# Altium schematic sheet 04_BLE & WIFI module.SchDoc
size A4
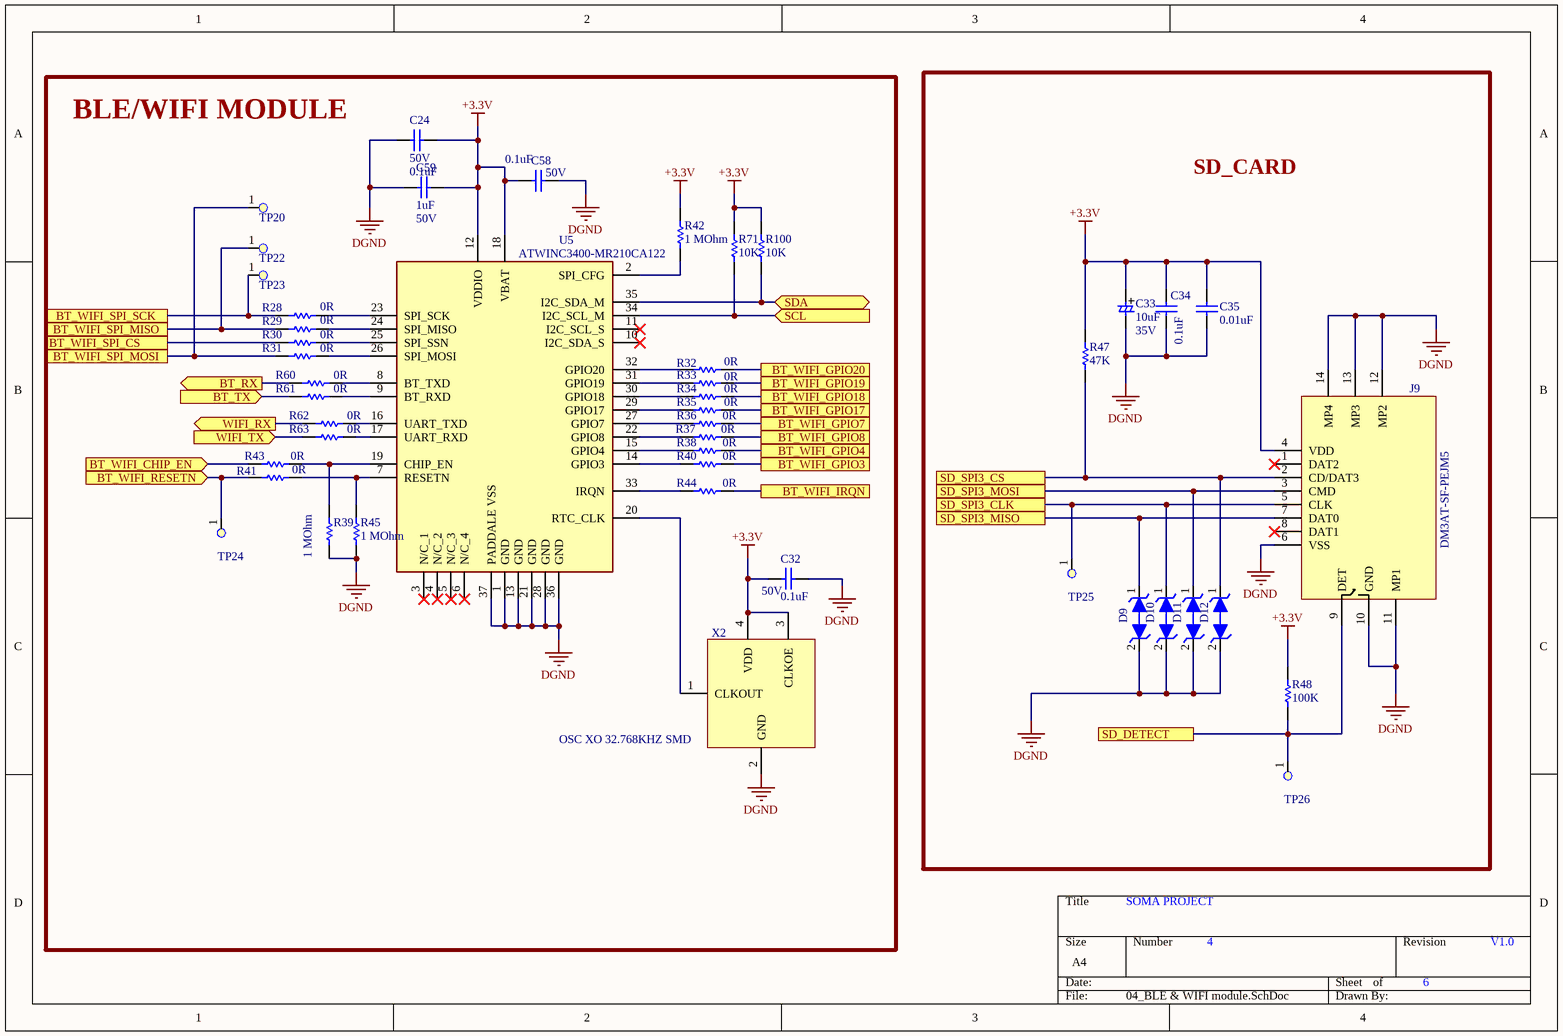
[diagram p0: 04_BLE & WIFI module.SchDoc]

## Parts
C24  Rating: 50V  [C0402]  (hidden comment: 0.1uF)
C32  Rating: 50V  [C0402]  (hidden comment: 0.1uF)
C33  Rating: 35V  [CAPAE430X540N]  (hidden comment: 10uF)
C34  0.1uF  [C0603]
C35  0.01uF  [C0402]
C58  Rating: 50V  [C0402]  (hidden comment: 0.1uF)
C59  value 1uF  Rating: 50V  [C0603]  (hidden comment: CAP CER 1UF 50V X5R 0603)
D9  TVS DIODE 3.3VWM 11.5VC SOD923  [SOD1006X40N_BI]  (value not drawn)
D10  TVS DIODE 3.3VWM 11.5VC SOD923  [SOD1006X40N_BI]  (value not drawn)
D11  TVS DIODE 3.3VWM 11.5VC SOD923  [SOD1006X40N_BI]  (value not drawn)
D12  TVS DIODE 3.3VWM 11.5VC SOD923  [SOD1006X40N_BI]  (value not drawn)
J9  value DM3AT-SF-PEJM5  [HIROSE_DM3AT-SF-PEJM5]  (hidden comment: CONN MICRO SD CARD PUSH-PUSH R/A)
R28  value 0R  [R0402]  (hidden comment: RES SMD 0 OHM JUMPER 1/16W 0402)
R29  value 0R  [R0402]  (hidden comment: RES SMD 0 OHM JUMPER 1/16W 0402)
R30  value 0R  [R0402]  (hidden comment: RES SMD 0 OHM JUMPER 1/16W 0402)
R31  value 0R  [R0402]  (hidden comment: RES SMD 0 OHM JUMPER 1/16W 0402)
R32  value 0R  [R0402]  (hidden comment: RES SMD 0 OHM JUMPER 1/16W 0402)
R33  value 0R  [R0402]  (hidden comment: RES SMD 0 OHM JUMPER 1/16W 0402)
R34  value 0R  [R0402]  (hidden comment: RES SMD 0 OHM JUMPER 1/16W 0402)
R35  value 0R  [R0402]  (hidden comment: RES SMD 0 OHM JUMPER 1/16W 0402)
R36  value 0R  [R0402]  (hidden comment: RES SMD 0 OHM JUMPER 1/16W 0402)
R37  value 0R  [R0402]  (hidden comment: RES SMD 0 OHM JUMPER 1/16W 0402)
R38  value 0R  [R0402]  (hidden comment: RES SMD 0 OHM JUMPER 1/16W 0402)
R39  1 MOhm  [R0603]
R40  value 0R  [R0402]  (hidden comment: RES SMD 0 OHM JUMPER 1/16W 0402)
R41  value 0R  [R0402]  (hidden comment: RES SMD 0 OHM JUMPER 1/16W 0402)
R42  1 MOhm  [R0603]
R43  value 0R  [R0402]  (hidden comment: RES SMD 0 OHM JUMPER 1/16W 0402)
R44  value 0R  [R0402]  (hidden comment: RES SMD 0 OHM JUMPER 1/16W 0402)
R45  1 MOhm  [R0603]
R47  47K  [R0402]
R48  100K  [R0402]
R60  value 0R  [R0402]  (hidden comment: RES SMD 0 OHM JUMPER 1/16W 0402)
R61  value 0R  [R0402]  (hidden comment: RES SMD 0 OHM JUMPER 1/16W 0402)
R62  value 0R  [R0402]  (hidden comment: RES SMD 0 OHM JUMPER 1/16W 0402)
R63  value 0R  [R0402]  (hidden comment: RES SMD 0 OHM JUMPER 1/16W 0402)
R71  10K  [R0402]
R100  10K  [R0402]
TP20  Test Point,1.6mm Diameter,SMD  [TP_63C]  (value not drawn)  (no BOM)
TP22  Test Point,1.6mm Diameter,SMD  [TP_63C]  (value not drawn)  (no BOM)
TP23  Test Point,1.6mm Diameter,SMD  [TP_63C]  (value not drawn)  (no BOM)
TP24  Test Point,1.6mm Diameter,SMD  [TP_63C]  (value not drawn)  (no BOM)
TP25  Test Point,1.6mm Diameter,SMD  [TP_63C]  (value not drawn)  (no BOM)
TP26  Test Point,1.6mm Diameter,SMD  [TP_63C]  (value not drawn)  (no BOM)
U5  value ATWINC3400-MR210CA122  [MICROCHIP_ATWINC3400-MR210xA]  (hidden comment: RX TXRX MODULE WIFI CHIP SMD)
X2  OSC XO 32.768KHZ SMD  [XTAL320X150X70-4N]

## Blocks framed on the sheet
BLE/WIFI MODULE: C24 C32 C58 C59 R28-R45 R60-R63 R71 R100 TP20 TP22-TP24 U5 X2
SD_CARD: C33-C35 D9-D12 J9 R47 R48 TP25 TP26

## Ports
BT_RX (out), BT_TX (in), BT_WIFI_CHIP_EN (in), BT_WIFI_GPIO3, BT_WIFI_GPIO4, BT_WIFI_GPIO7, BT_WIFI_GPIO8, BT_WIFI_GPIO17, BT_WIFI_GPIO18, BT_WIFI_GPIO19, BT_WIFI_GPIO20, BT_WIFI_IRQN, BT_WIFI_RESETN (in), BT_WIFI_SPI_CS, BT_WIFI_SPI_MISO, BT_WIFI_SPI_MOSI, BT_WIFI_SPI_SCK, SCL (in), SD_DETECT, SD_SPI3_CLK, SD_SPI3_CS, SD_SPI3_MISO, SD_SPI3_MOSI, SDA (bidir), WIFI_RX (out), WIFI_TX (in)

## Nets
+3.3V: C24.1 C32.2 C33.2 C34.2 C35.2 C58.2 C59.1 J9.4(VDD) R42.1 R47.2 R48.2 R71.2 R100.2 U5.12(VDDIO) U5.18(VBAT) X2.3(CLKOE) X2.4(VDD)
DGND: C24.2 C32.1 C33.1 C34.1 C35.1 C58.1 C59.2 D9.2(A) D10.2(A) D11.2(A) D12.2(A) J9.6(VSS) J9.10(GND) J9.11(MP1) J9.12(MP2) J9.13(MP3) J9.14(MP4) R39.2 R45.1 U5.1(GND) U5.13(GND) U5.21(GND) U5.28(GND) U5.36(GND) U5.37(PADDALE_VSS) X2.2(GND)
BT_RX: R60.1 ; port BT_RX
BT_TX: R61.1 ; port BT_TX
BT_WIFI_CHIP_EN: R43.1 ; port BT_WIFI_CHIP_EN
BT_WIFI_GPIO3: R40.2 ; port BT_WIFI_GPIO3
BT_WIFI_GPIO4: R38.2 ; port BT_WIFI_GPIO4
BT_WIFI_GPIO7: R36.2 ; port BT_WIFI_GPIO7
BT_WIFI_GPIO8: R37.2 ; port BT_WIFI_GPIO8
BT_WIFI_GPIO17: R35.2 ; port BT_WIFI_GPIO17
BT_WIFI_GPIO18: R34.2 ; port BT_WIFI_GPIO18
BT_WIFI_GPIO19: R33.2 ; port BT_WIFI_GPIO19
BT_WIFI_GPIO20: R32.2 ; port BT_WIFI_GPIO20
BT_WIFI_IRQN: R44.2 ; port BT_WIFI_IRQN
BT_WIFI_RESETN: R41.1 TP24.1 ; port BT_WIFI_RESETN
BT_WIFI_SPI_CS: R30.1 ; port BT_WIFI_SPI_CS
BT_WIFI_SPI_MISO: R29.1 TP22.1 ; port BT_WIFI_SPI_MISO
BT_WIFI_SPI_MOSI: R31.1 TP20.1 ; port BT_WIFI_SPI_MOSI
BT_WIFI_SPI_SCK: R28.1 TP23.1 ; port BT_WIFI_SPI_SCK
SCL: R71.1 U5.34(I2C_SCL_M) ; port SCL
SD_DETECT: J9.9(DET) R48.1 TP26.1 ; port SD_DETECT
SD_SPI3_CLK: D10.1(K) J9.5(CLK) TP25.1 ; port SD_SPI3_CLK
SD_SPI3_CS: D12.1(K) J9.2(CD/DAT3) R47.1 ; port SD_SPI3_CS
SD_SPI3_MISO: D9.1(K) J9.7(DAT0) ; port SD_SPI3_MISO
SD_SPI3_MOSI: D11.1(K) J9.3(CMD) ; port SD_SPI3_MOSI
SDA: R100.1 U5.35(I2C_SDA_M) ; port SDA
WIFI_RX: R62.1 ; port WIFI_RX
WIFI_TX: R63.1 ; port WIFI_TX
NetR28_2: R28.2 U5.23(SPI_SCK)
NetR29_2: R29.2 U5.24(SPI_MISO)
NetR30_2: R30.2 U5.25(SPI_SSN)
NetR31_2: R31.2 U5.26(SPI_MOSI)
NetR32_1: R32.1 U5.32(GPIO20)
NetR33_1: R33.1 U5.31(GPIO19)
NetR34_1: R34.1 U5.30(GPIO18)
NetR35_1: R35.1 U5.29(GPIO17)
NetR36_1: R36.1 U5.27(GPIO7)
NetR37_1: R37.1 U5.22(GPIO8)
NetR38_1: R38.1 U5.15(GPIO4)
NetR39_1: R39.1 R43.2 U5.19(CHIP_EN)
NetR40_1: R40.1 U5.14(GPIO3)
NetR41_2: R41.2 R45.2 U5.7(RESETN)
NetR42_2: R42.2 U5.2(SPI_CFG)
NetR44_1: R44.1 U5.33(IRQN)
NetR60_2: R60.2 U5.8(BT_TXD)
NetR61_2: R61.2 U5.9(BT_RXD)
NetR62_2: R62.2 U5.16(UART_TXD)
NetR63_2: R63.2 U5.17(UART_RXD)
NetU5_20: U5.20(RTC_CLK) X2.1(CLKOUT)

Not connected (* = marked no-connect by the designer): J9 1(DAT2)* 8(DAT1)*; U5 3(N/C_1)* 4(N/C_2)* 5(N/C_3)* 6(N/C_4)* 10(I2C_SDA_S)* 11(I2C_SCL_S)*

## Notes on the sheet
- SOMA PROJECT
- 4
- 6
- V1.0

## Library data of the parts
C24 C32 C58 = CAP CER 0.1UF 50V X7R 0402: Manufacturer: AVX; Manufacturer part Number: 04025C104KAT2A; Tolerance: ±10%; Distributor: Mouser; Package: 0402; Type: CAP; Operating Temperature: -55°C ~ 125°C; Distributor part Number: 581-04025C104KAT2A; Reference link: https://www.mouser.in/ProductDetail/AVX/04025C104KAT2A?qs=%2Fha2pyFaduhvAwOoQhW9hDDlPxePcbvdgYQJEdBTMGpxgpoTOSNvPA%3D%3D; Value: 0.1uF; Unit Price: ₹7.47
C33 = CAP ALUM 10UF 20% 35V SMD: Manufacturer: Panasonic; Manufacturer part Number: EEE-1VA100WR; Operating Temperature: 40°C ~ 85°C; Package: 0.169" L x 0.169" W (4.30mm x 4.30mm); Reference link: https://www.digikey.com/product-detail/en/panasonic-electronic-components/EEE-1VA100WR/PCE3948TR-ND/761836; Distributor: Digi-Key; Distributor part Number: PCE3948TR-ND; Type: CAP; Tolerance: ±20%; Value: 10uF; Unit Price: $0.08326
C34 = CAP CER 0.1UF 10V X7R 0603: Manufacturer: Würth Elektronik; Manufacturer part Number: 885012206020; Tolerance: ±10%; Operating Temperature: -55°C ~ 125°C; Reference link: https://www.digikey.com/en/products/detail/w%C3%BCrth-elektronik/885012206020/5453794; Package: 0603 (1608 Metric); Distributor: Digikey; Distributor part Number: 732-7939-1-ND; Type: CAP; Unit Price: $0.10000; Value: 0.1uF; Rating: 10V
C35 = CAP CER 0.01uF 50V X7R 0402: Manufacturer: Yageo; Manufacturer part Number: CC0402KRX7R9BB103; Tolerance: ±10%; Operating Temperature: -55°C ~ 125°C; Package: 0402; Distributor: Digikey; Reference link: https://www.digikey.in/product-detail/en/yageo/CC0402KRX7R9BB103/311-1349-1-ND/2103133; Distributor part Number: 311-1349-1-ND; Type: CAP; Rating: 50V; Value: 0.01uF; Unit Price: 0.00609
C59 = CAP CER 1UF 50V X5R 0603: Manufacturer: Taiyo Yuden; Manufacturer part Number: UMK107BJ105KA-T; Tolerance: ±10%; Operating Temperature: -55°C ~ 125°C; Reference link: https://www.digikey.in/product-detail/en/taiyo-yuden/UMK107BJ105KA-T/587-2400-2-ND/2178919; Package: 0603; Distributor: Digikey; Distributor part Number: 587-2400-2-ND; Type: CAP; Unit Price: 2.57370
D9-D12 = TVS DIODE 3.3VWM 11.5VC SOD923: 11.5V Clamp 2A (8/20µs) Ipp Tvs Diode Surface Mount SOD-923; Manufacturer Part Number: ESD9B3.3ST5G; Manufacturer: ON Semiconductor; Value: 3.3V 11.5V; Assembly Option: DNP; Tolerance: NA; Operating Temperature: -55°C to +150°C; Distributor: Digikey; Distributor part Number: ESD9B3.3ST5GOSTR-ND; Package: SOD-923; Rating: 3.3V 11.5V; Reference link: https://www.digikey.com/product-detail/en/on-semiconductor/ESD9B3.3ST5G/ESD9B3.3ST5GOSTR-ND/1973669; Type: TVS; Unit Price: $0.24000
J9 = CONN MICRO SD CARD PUSH-PUSH R/A: Manufacturer: Hirose Electric Co Ltd; Rating: NA; Unit Price: $2.50000; Distributor: Digikey; Distributor part Number: HR1964CT-ND; Manufacturer part Number: DM3AT-SF-PEJM5; Reference link: https://www.digikey.com/en/products/detail/hirose-electric-co-ltd/DM3AT-SF-PEJM5/2533565; Tolerance: NA; Type: Connector and Ejector
R28-R38 R40 R41 R43 R44 R60-R63 = RES SMD 0 OHM JUMPER 1/16W 0402: 0 Ohms Jumper 0.063W, 1/16W Chip Resistor 0402 (1005 Metric) Moisture Resistant Thick Film; Manufacturer: Yageo; Manufacturer part Number: RC0402JR-070RP; Distributor: Digikey; Distributor part Number: YAG1279TR-ND; Unit Price: 0.00377; Reference link: https://www.digikey.sg/product-detail/en/yageo/RC0402JR-070RP/YAG1279TR-ND/4935294; Type: RES; Rating: 0.063W, 1/16W; Package: 0402 (1005 Metric); Tolerance: Jumper; Part Status: Active; Operating Temperature: -55°C ~ 155°C; Size / Dimension: 0.039" L x 0.020" W (1.00mm x 0.50mm)
R39 R42 R45 = RES 1M OHM 1% 1/10W 0603: Manufacturer part Number: RC0603FR-131ML; Manufacturer: Yageo; Operating Temperature: -55°C ~ 155°C; Distributor: Digikey; Package: 0603 (1608 Metric); Type: RES; Distributor part Number: 13-RC0603FR-131MLCT-ND; Reference link: https://www.digikey.com/en/products/detail/yageo/RC0603FR-131ML/13694152; Rating: 1/10W; Unit Price: $0.10000; Value: 1 MOhm
R47 = RES SMD 47K OHM 5% 1/10W 0402: Manufacturer part Number: ERJ-2GEJ473X; Manufacturer: Panasonic Electronic Components; Assembly Option: DNP; Distributor: Digikey; Reference link: https://www.digikey.in/product-detail/en/panasonic-electronic-components/ERJ-2GEJ473X/P47KJCT-ND/147021; Type: RES; Distributor part Number: P47KJCT-ND; Rating: 1/10W; Tolerance: ±5%; Package: 0402; Operating Temperature: -55°C ~ 155°C; Value: 47K; Unit Price: 7.46000
R48 = RES SMD 100K OHM 1% 1/10W 0402: 100 kOhms ±1% 0.1W, 1/10W Chip Resistor 0402 (1005 Metric) Automotive AEC-Q200 Thick Film; Manufacturer: Panasonic Electronic Components; Manufacturer part Number: ERJ-2RKF1003X; Operating Temperature: -55°C ~ 155°C; Package: 0402; Distributor: Digikey; Type: RES; Reference link: https://www.digikey.in/product-detail/en/panasonic-electronic-components/ERJ-2RKF1003X/P100KLCT-ND/194127; Distributor part Number: P100KLCT-ND; Tolerance: ±1%; Rating: 1/10W; Value: 100K; Unit Price: 7.46000
R71 R100 = RES SMD 10K OHM 1% 1/10W 0402: 10 kOhms ±1% 0.1W, 1/10W Chip Resistor 0402 (1005 Metric) Automotive AEC-Q200 Thick Film; Manufacturer: Panasonic Electronic Components; Manufacturer part Number: ERJ-2RKF1002X; Operating Temperature: -55°C ~ 155°C; Reference link: https://www.digikey.in/product-detail/en/panasonic-electronic-components/ERJ-2RKF1002X/P10.0KLCT-ND/194119; Distributor: Digikey; Distributor part Number: P10.0KLCT-ND; Package: 0402; Type: RES; Rating: 1/10W; Cost: 0.00715; Tolerance: ±1%; Value: 10K
U5 = RX TXRX MODULE WIFI CHIP SMD: Manufacturer: Microchip Technology; Tolerance: NA; Rating: 2.5V ~ 4.2V; Distributor part Number: ATWINC3400-MR210CA122-ND; Unit Price: $11.93000; Reference link: https://www.digikey.com/en/products/detail/microchip-technology/ATWINC3400-MR210CA122/7898445; Type: IC; Manufacturer part Number: ATWINC3400-MR210CA122; Distributor: Digikey; Package: Module; Operating Temperature: -40°C ~ 85°C
X2 = OSC XO 32.768KHZ SMD: 32.768 kHz XO (Standard) CMOS Oscillator 1.2V ~ 5.5V Enable/Disable 4-SMD, No Lead; Manufacturer: Micro Crystal AG; Manufacturer part Number: OM-7604-C7-32.768KHZ-20PPM-TA-QC; Value: 1.2V ~ 5.5V,  0.5µA; Distributor: Digikey; Package: 4 SMD, No Lead; Operating Temperature: -40°C ~ 85°C; Type: Crystal; Distributor part Number: 2195-OM-7604-C7-32.768KHZ-20PPM-TA-QCCT-ND; Reference link: https://www.digikey.com/en/products/detail/micro-crystal-ag/OM-7604-C7-32-768KHZ-20PPM-TA-QC/10431069; Rating: 32.768kHz; Unit Price: $1.64000
TP20 TP22-TP26 = Test Point,1.6mm Diameter,SMD: AEMCI Part Number: *; Vendor: *; Vendor ID: *